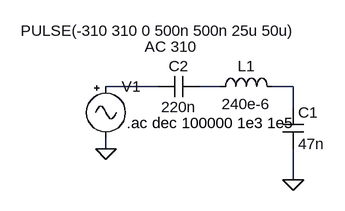
[diagram p0: schematic WaveUltrasonicOutputStage - Peaking.asc]
WaveUltrasonicOutputStage - Peaking.asc, the LTspice schematic file:
Version 4
SHEET 1 1040 420
WIRE 144 112 64 112
WIRE 240 112 208 112
WIRE 352 112 320 112
WIRE 352 144 352 112
WIRE 64 208 64 192
WIRE 352 256 352 208
FLAG 64 208 0
FLAG 352 256 0
SYMBOL Misc\\signal 64 96 R0
WINDOW 123 60 -46 Left 2
WINDOW 39 0 0 Left 0
WINDOW 3 -131 -70 Left 2
SYMATTR Value2 AC 310
SYMATTR Value PULSE(-310 310 0 500n 500n 25u 50u)
SYMATTR InstName V1
SYMBOL ind 224 128 R270
WINDOW 0 32 56 VTop 2
WINDOW 3 5 56 VBottom 2
SYMATTR InstName L1
SYMATTR Value 240e-6
SYMBOL cap 336 144 R0
SYMATTR InstName C1
SYMATTR Value 47n
SYMBOL cap 208 96 R90
WINDOW 0 0 32 VBottom 2
WINDOW 3 32 32 VTop 2
SYMATTR InstName C2
SYMATTR Value 220n
TEXT 96 168 Left 2 !.ac dec 100000 1e3 1e5

The netlist it stands for:
* WaveUltrasonicOutputStage - Peaking.asc
V1 N001 0 PULSE(-310 310 0 500n 500n 25u 50u) AC 310
L1 N002 N003 240e-6
C1 N003 0 47n
C2 N002 N001 220n
.ac dec 100000 1e3 1e5
.backanno
.end